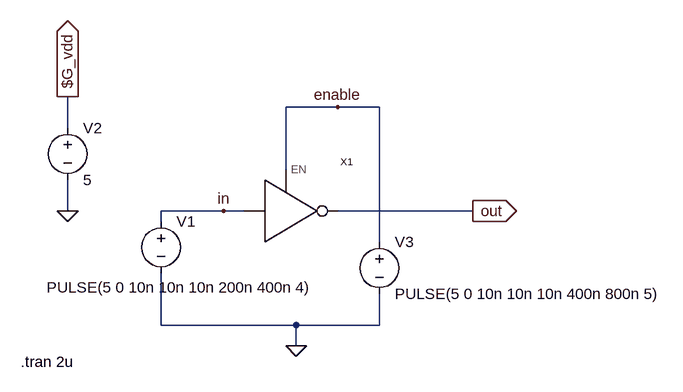
[diagram p0: schematic test_tri_state.asc]
test_tri_state.asc, the LTspice schematic file:
Version 4
SHEET 1 880 680
WIRE 256 16 176 16
WIRE 320 16 256 16
WIRE -160 48 -160 0
WIRE 176 112 176 16
WIRE -160 176 -160 128
WIRE 80 176 -16 176
WIRE 112 176 80 176
WIRE 464 176 256 176
WIRE -16 192 -16 176
WIRE 320 224 320 16
WIRE -16 352 -16 272
WIRE 192 352 -16 352
WIRE 320 352 320 304
WIRE 320 352 192 352
WIRE 192 384 192 352
FLAG 192 384 0
FLAG -160 176 0
FLAG -160 0 $G_vdd
IOPIN -160 0 Out
FLAG 464 176 out
IOPIN 464 176 Out
FLAG 80 176 in
FLAG 256 16 enable
SYMBOL en_inverter 144 176 R0
SYMATTR InstName X1
SYMBOL voltage -16 176 R0
WINDOW 3 -176 118 Left 2
WINDOW 123 0 0 Left 0
WINDOW 39 0 0 Left 0
SYMATTR InstName V1
SYMATTR Value PULSE(5 0 10n 10n 10n 200n 400n 4)
SYMBOL voltage -160 32 R0
SYMATTR InstName V2
SYMATTR Value 5
SYMBOL voltage 320 208 R0
WINDOW 123 0 0 Left 0
WINDOW 39 0 0 Left 0
SYMATTR InstName V3
SYMATTR Value PULSE(5 0 10n 10n 10n 400n 800n 5)
TEXT -232 408 Left 2 !.tran 2u

The netlist it stands for:
* test_tri_state.asc
XX1 in out enable en_inverter  ; pins Vin Vout EN
V1 in 0 PULSE(5 0 10n 10n 10n 200n 400n 4)
V2 $G_vdd 0 5
V3 enable 0 PULSE(5 0 10n 10n 10n 400n 800n 5)
.tran 2u
.backanno
.end